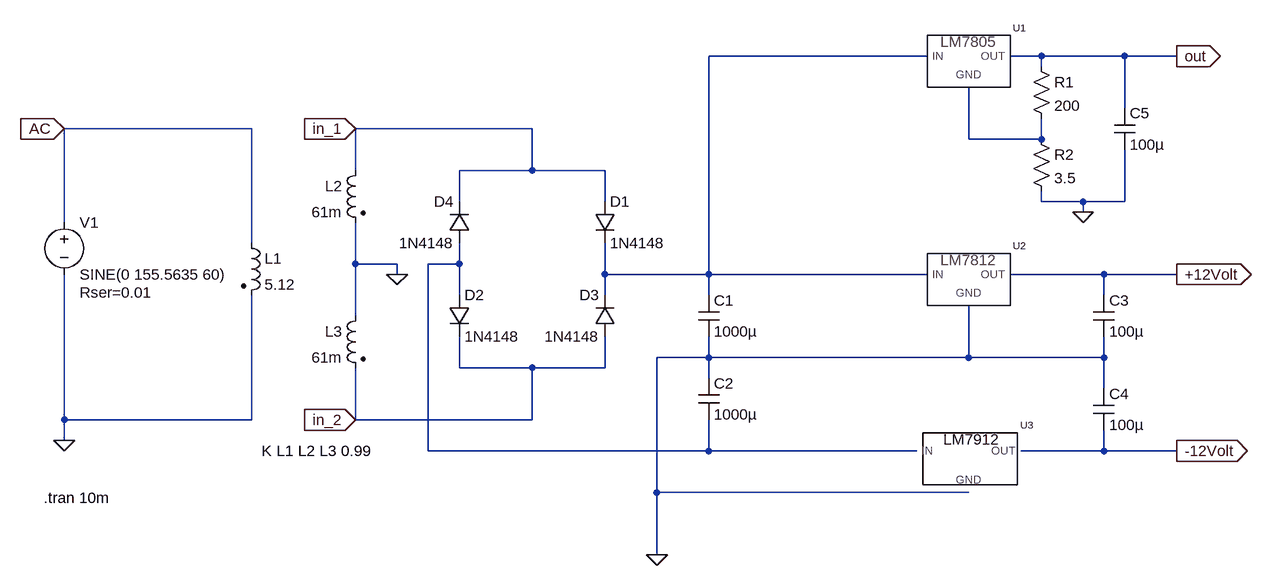
[diagram p0: schematic Voltage_Regular.asc]
Voltage_Regular.asc, the LTspice schematic file:
Version 4
SHEET 1 1496 680
WIRE 960 -240 624 -240
WIRE 1136 -240 1088 -240
WIRE 1264 -240 1136 -240
WIRE 1344 -240 1264 -240
WIRE 1136 -224 1136 -240
WIRE 1264 -160 1264 -240
WIRE -80 -128 -368 -128
WIRE 352 -128 80 -128
WIRE 1024 -112 1024 -192
WIRE 1136 -112 1136 -144
WIRE 1136 -112 1024 -112
WIRE 80 -64 80 -128
WIRE 352 -64 352 -128
WIRE 352 -64 240 -64
WIRE 464 -64 352 -64
WIRE 240 -16 240 -64
WIRE 464 -16 464 -64
WIRE 1136 -16 1136 -32
WIRE 1200 -16 1136 -16
WIRE 1264 -16 1264 -96
WIRE 1264 -16 1200 -16
WIRE 1200 0 1200 -16
WIRE -368 16 -368 -128
WIRE -80 48 -80 -128
WIRE 80 80 80 16
WIRE 144 80 80 80
WIRE 240 80 240 48
WIRE 240 80 192 80
WIRE 144 96 144 80
WIRE 464 96 464 48
WIRE 624 96 624 -240
WIRE 624 96 464 96
WIRE 960 96 624 96
WIRE 1232 96 1088 96
WIRE 1344 96 1232 96
WIRE 240 128 240 80
WIRE 464 128 464 96
WIRE 624 128 624 96
WIRE 1232 128 1232 96
WIRE 80 160 80 80
WIRE 624 224 624 192
WIRE 624 224 544 224
WIRE 1024 224 1024 144
WIRE 1024 224 624 224
WIRE 1232 224 1232 192
WIRE 1232 224 1024 224
WIRE 240 240 240 192
WIRE 352 240 240 240
WIRE 464 240 464 192
WIRE 464 240 352 240
WIRE 624 256 624 224
WIRE 1232 272 1232 224
WIRE -368 320 -368 96
WIRE -80 320 -80 128
WIRE -80 320 -368 320
WIRE 80 320 80 240
WIRE 352 320 352 240
WIRE 352 320 80 320
WIRE -368 352 -368 320
WIRE 192 368 192 80
WIRE 624 368 624 320
WIRE 624 368 192 368
WIRE 944 368 624 368
WIRE 1232 368 1232 336
WIRE 1232 368 1104 368
WIRE 1344 368 1232 368
WIRE 544 432 544 224
WIRE 1024 432 544 432
WIRE 544 528 544 432
FLAG -368 352 0
FLAG 144 96 0
FLAG 80 -128 in_1
IOPIN 80 -128 In
FLAG 80 320 in_2
IOPIN 80 320 In
FLAG -368 -128 AC
IOPIN -368 -128 In
FLAG 544 528 0
FLAG 1344 368 -12Volt
IOPIN 1344 368 Out
FLAG 1344 96 +12Volt
IOPIN 1344 96 Out
FLAG 1200 0 0
FLAG 1344 -240 out
IOPIN 1344 -240 Out
SYMBOL voltage -368 0 R0
WINDOW 123 0 0 Left 0
WINDOW 39 24 124 Left 2
SYMATTR SpiceLine Rser=0.01
SYMATTR InstName V1
SYMATTR Value SINE(0 155.5635 60)
SYMBOL ind2 -96 32 R0
SYMATTR InstName L1
SYMATTR Value 5.12
SYMATTR Type ind
SYMBOL ind2 96 -80 M0
SYMATTR InstName L2
SYMATTR Value 61m
SYMATTR Type ind
SYMBOL ind2 96 144 M0
SYMATTR InstName L3
SYMATTR Value 61m
SYMATTR Type ind
SYMBOL diode 448 -16 R0
SYMATTR InstName D1
SYMATTR Value 1N4148
SYMBOL diode 224 128 R0
SYMATTR InstName D2
SYMATTR Value 1N4148
SYMBOL diode 480 192 R180
WINDOW 0 24 64 Left 2
WINDOW 3 24 0 Left 2
SYMATTR InstName D3
SYMATTR Value 1N4148
SYMBOL diode 256 48 R180
WINDOW 0 24 64 Left 2
WINDOW 3 24 0 Left 2
SYMATTR InstName D4
SYMATTR Value 1N4148
SYMBOL cap 608 128 R0
SYMATTR InstName C1
SYMATTR Value 1000µ
SYMBOL cap 608 256 R0
SYMATTR InstName C2
SYMATTR Value 1000µ
SYMBOL LM7805 1024 -240 R0
SYMATTR InstName U1
SYMBOL LM7812 1024 96 R0
SYMATTR InstName U2
SYMBOL LM7912 1024 368 R0
SYMATTR InstName U3
SYMBOL cap 1216 128 R0
SYMATTR InstName C3
SYMATTR Value 100µ
SYMBOL cap 1216 272 R0
SYMATTR InstName C4
SYMATTR Value 100µ
SYMBOL cap 1248 -160 R0
SYMATTR InstName C5
SYMATTR Value 100µ
SYMBOL res 1120 -240 R0
SYMATTR InstName R1
SYMATTR Value 200
SYMBOL res 1120 -128 R0
SYMATTR InstName R2
SYMATTR Value 3.5
TEXT -64 368 Left 2 !K L1 L2 L3 0.99
TEXT -400 440 Left 2 !.tran 10m

The netlist it stands for:
* Voltage_Regular.asc
V1 AC 0 SINE(0 155.5635 60) Rser=0.01
L1 AC 0 5.12
L2 in_1 0 61m
L3 0 in_2 61m
D1 in_1 N001 1N4148
D2 N003 in_2 1N4148
D3 in_2 N001 1N4148
D4 N003 in_1 1N4148
C1 N001 0 1000µ
C2 0 N003 1000µ
XU1 N001 N002 out LM7805 LM7805  ; pins IN GND OUT
XU2 N001 0 +12Volt LM7812 LM7812  ; pins IN GND OUT
XU3 N003 0 -12Volt LM7912 LM7912  ; pins IN GND OUT
C3 +12Volt 0 100µ
C4 0 -12Volt 100µ
C5 out 0 100µ
R1 out N002 200
R2 N002 0 3.5
.model D D
.lib standard.dio
K L1 L2 L3 0.99
.tran 10m
.lib LM7805_7812_7815.lib
.lib C:\Users\eeta\Documents\LTspiceXVII\lib\sub\lm7905_7912_7915.lib
.backanno
.end